# EAGLE schematic hh2019_proto (EAGLE 9.2.2)
Assembly variants: PRODUCTION

## Sheet 1 of 3
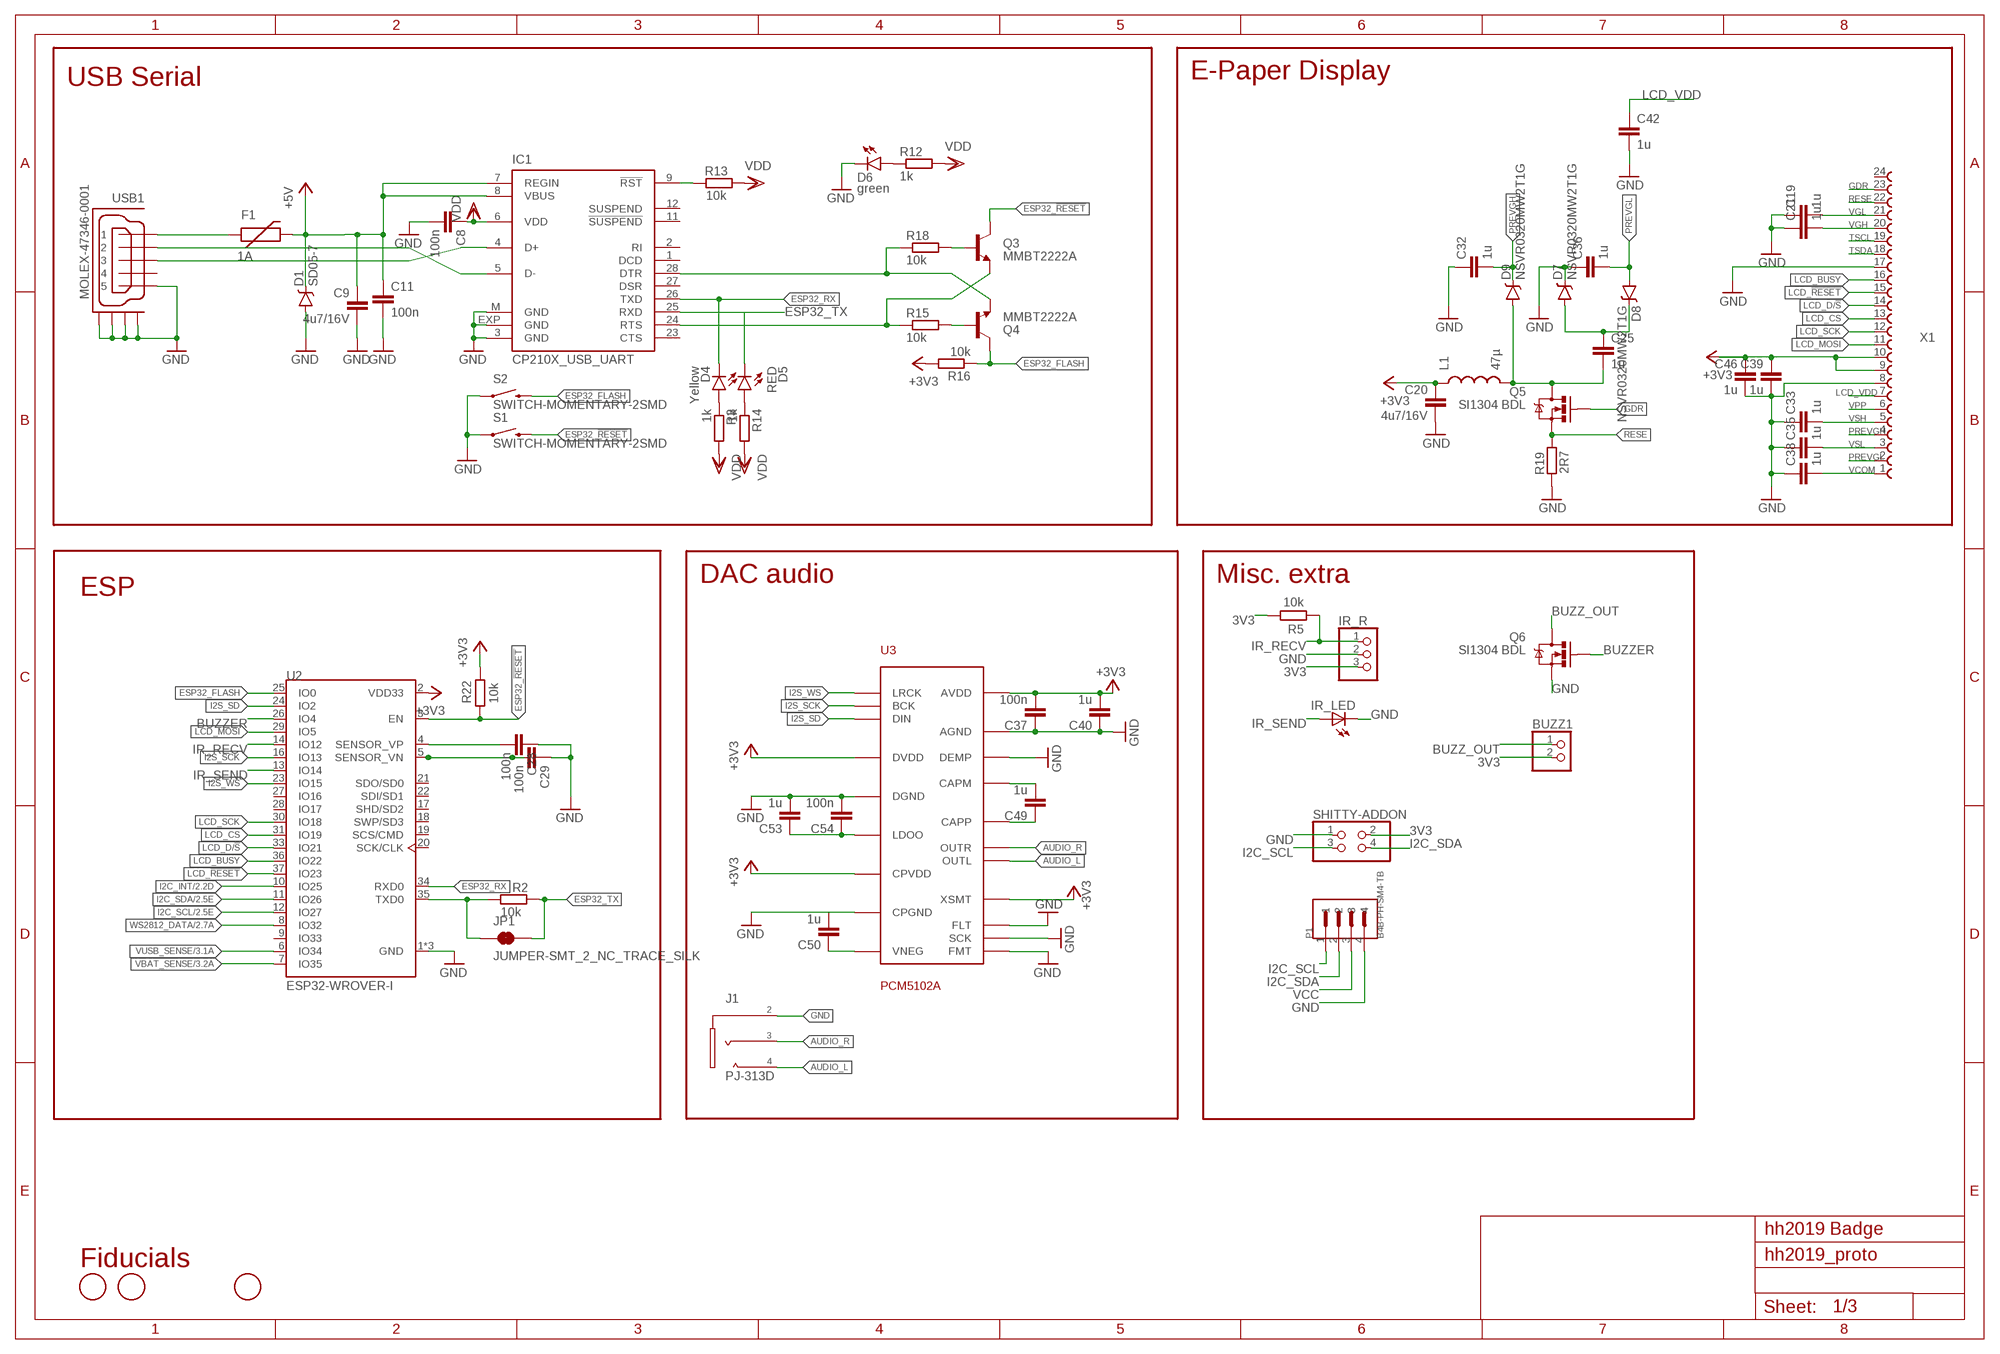
[diagram p0: schematic, sheet 1]

### Parts
BUZZ1  PINHD-1X2  [1X02]
C8  100n  C0603-DASHES  [C0603-DASHES]
C9  4u7/16V  C-EUC0805  [C0805]
C11  100n  C0603-DASHES  [C0603-DASHES]
C19  1u  C0603-DASHES  [C0603-DASHES]
C20  4u7/16V  C-EUC0805  [C0805]
C21  1u  C0603-DASHES  [C0603-DASHES]
C25  1u  C0603-DASHES  [C0603-DASHES]
C28  100n  C0603-DASHES  [C0603-DASHES]
C29  100n  C0603-DASHES  [C0603-DASHES]
C32  1u  C0603-DASHES  [C0603-DASHES]
C33  1u  C0603-DASHES  [C0603-DASHES]
C35  1u  C0603-DASHES  [C0603-DASHES]
C36  1u  C0603-DASHES  [C0603-DASHES]
C37  100n  C-EUC0603  [C0603]
C38  1u  C0603-DASHES  [C0603-DASHES]
C39  1u  C0603-DASHES  [C0603-DASHES]
C40  1u  C-EUC0603  [C0603]
C42  1u  C0603-DASHES  [C0603-DASHES]
C46  1u  C0603-DASHES  [C0603-DASHES]
C49  1u  C-EUC0603  [C0603]
C50  1u  C-EUC0603  [C0603]
C53  1u  C-EUC0603  [C0603]
C54  100n  C-EUC0603  [C0603]
D1  SD05-7  DIODE-SCHOTTKY-PMEG4005EJ  [SOD-323]
D4  Yellow  LED0603  [LED-0603]
D5  RED  LED0603  [LED-0603]
D6  green  LED0603  [LED-0603]
D7  NSVR0320MW2T1G  BAT20JFILM  [SOD-323]
D8  NSVR0320MW2T1G  BAT20JFILM  [SOD-323]
D9  NSVR0320MW2T1G  BAT20JFILM  [SOD-323]
F1  1A  PTCSMD  [PTC-1206]
FD1  FIDUCIAL  [FIDUCIAL_1MM]
FD4  FIDUCIAL  [FIDUCIAL_1MM]
FD5  FIDUCIAL  [FIDUCIAL_1MM]
IC1  CP210X_USB_UART  [MLP28]
IR_LED  LED5MM  [LED5MM]
IR_R  PINHD-1X3  [1X03]
J1  PJ-313D  [PJ-313D]
JP1  JUMPER-SMT_2_NC_TRACE_SILK  [SMT-JUMPER_2_NC_TRACE_SILK]
L1  47µ  INDUCTOR1210  [1210]
P1  B4B-PH-SM4-TB  [JST_B4B-PH-SM4-TB]
Q3  MMBT2222A  TRANSISTOR_NPNMMBT2222A  [SOT23-3]
Q4  MMBT2222A  TRANSISTOR_NPNMMBT2222A  [SOT23-3]
Q5  SI1304 BDL  MOSFET-NCHANNEL2N7002PW  [SOT323]
Q6  SI1304 BDL  MOSFET-NCHANNEL2N7002PW  [SOT323]
R2  10k  R0603-DASHES  [R0603-DASHES]
R3  1k  R0603-DASHES  [R0603-DASHES]
R5  10k  R0603-DASHES  [R0603-DASHES]
R12  1k  R0603-DASHES  [R0603-DASHES]
R13  10k  R0603-DASHES  [R0603-DASHES]
R14  1k  R0603-DASHES  [R0603-DASHES]
R15  10k  R0603-DASHES  [R0603-DASHES]
R16  10k  R0603-DASHES  [R0603-DASHES]
R18  10k  R0603-DASHES  [R0603-DASHES]
R19  2R7  R0603-DASHES  [R0603-DASHES]
R22  10k  R0603-DASHES  [R0603-DASHES]
S1  SWITCH-MOMENTARY-2SMD  [TACTILE-SWITCH-SMD]
S2  SWITCH-MOMENTARY-2SMD  [TACTILE-SWITCH-SMD]
SHITTY-ADDON  PINHD-2X2  [2X02]
U2  ESP32-WROVER-I  [XCVR_ESP32-WROVER-I]
U3  PCM5102A  [PCM5102A]
USB1  MOLEX-47346-0001  [MOLEX-47364-0001]
X1  68712414022  [68712414022]

### Nets
3V3: BUZZ1.2 C20.1 C37.2 C39.1 C40.2 C46.1 IR_R.3 L1.1 R5.1 R16.2 R22.1 SHITTY-ADDON.2 U2.2(VDD33) U3.P$1(CPVDD) U3.P$8(AVDD) U3.P$17(XSMT) U3.P$20(DVDD) X1.9 X1.10 ; supply symbol labelled +3V3 ; also sheet 2
+5V [GND/3V3]: C9.1 C11.1 D1.C F1.2 IC1.7(REGIN) IC1.8(VBUS) ; also sheet 2,3
AUDIO_L: J1.4_1 J1.4_2 U3.P$6(OUTL)
AUDIO_R: J1.3_1 J1.3_2 U3.P$7(OUTR)
BUZZ_OUT: BUZZ1.1 Q6.3(D)
BUZZER: Q6.1(G) U2.26(IO4)
CAPM: C49.2 U3.P$4(CAPM)
CAPP: C49.1 U3.P$2(CAPP)
ESP32_!RESET: Q3.3(C) R22.2 S1.3 U2.3(EN)
ESP32_FLASH: Q4.3(C) R16.1 S2.3 U2.25(IO0)
ESP32_RX: D4.C IC1.26(TXD) U2.34(RXD0)
ESP32_TX: D5.C IC1.25(RXD) JP1.2 R2.1
ESP32_TX_PRE: JP1.1 R2.2 U2.35(TXD0)
GDR: Q5.1(G) X1.23
GND [GND/3V3]: C8.2 C9.2 C11.2 C19.1 C20.2 C21.1 C28.1 C29.1 C32.1 C33.1 C35.1 C36.1 C37.1 C38.1 C39.2 C40.1 C42.2 C46.2 C50.2 C53.2 C54.2 D1.A D6.C D7.C IC1.3(GND) IC1.EXP(GND) IC1.M(GND) IR_LED.K(C) IR_R.2 J1.2_1 J1.2_2 P1.4 Q6.2(S) R19.2 S1.1 S2.1 SHITTY-ADDON.1 U2.1(GND) U2.15(GND) U2.38(GND) U3.P$3(CPGND) U3.P$9(AGND) U3.P$10(DEMP) U3.P$11(FLT) U3.P$12(SCK) U3.P$16(FMT) U3.P$19(DGND) USB1.5 USB1.GND1 USB1.GND2 USB1.GND3 USB1.GND4 X1.8 X1.17 ; also sheet 2,3
I2C_INT: U2.10(IO25) ; also sheet 2
I2C_SCL: P1.1 SHITTY-ADDON.3 U2.12(IO27) ; also sheet 2
I2C_SDA: P1.2 SHITTY-ADDON.4 U2.11(IO26) ; also sheet 2
I2S_SCK: U2.16(IO13) U3.P$13(BCK)
I2S_SD: U2.24(IO2) U3.P$14(DIN)
I2S_WS: U2.23(IO15) U3.P$15(LRCK)
IR_RECV: IR_R.1 R5.2 U2.14(IO12)
IR_SEND: IR_LED.A U2.13(IO14)
LCD_!RESET: U2.37(IO23) X1.15
LCD_BUSY: U2.36(IO22) X1.16
LCD_CS: U2.31(IO19) X1.13
LCD_D/!S: U2.33(IO21) X1.14
LCD_MOSI: U2.29(IO5) X1.11
LCD_SCK: U2.30(IO18) X1.12
LCD_VDD: C42.1 X1.7
LDO0: C53.1 C54.1 U3.P$18(LDOO)
N$10: IC1.24(RTS) Q3.2(E) R15.1
N$11: IC1.28(DTR) Q4.2(E) R18.1
N$13: Q4.1(B) R15.2
N$14: Q3.1(B) R18.2
N$22: C25.1 D7.A D8.C
N$23: C25.2 D9.A L1.2 Q5.3(D)
N$26: D6.A R12.1
N$27: D4.A R3.1
N$28: D5.A R14.1
N$32 [GND/3V3]: F1.1 USB1.1
N$42: C28.2 U2.4(SENSOR_VP)
N$43: C29.2 U2.5(SENSOR_VN)
PREVGH: C32.2 D9.C X1.4
PREVGL: C36.2 D8.A X1.2
RESE: Q5.2(S) R19.1 X1.22
RST: IC1.9(!RST) R13.2
TSCL: X1.19
TSDA: X1.18
USB_DN_CON: IC1.5(D-) USB1.2
USB_DP_CON: IC1.4(D+) USB1.3
VBAT_SENSE: U2.7(IO35) ; also sheet 3
VCC [FAT]: P1.3 ; also sheet 2
VCOM: C38.2 X1.1
VDD: C8.1 IC1.6(VDD) R3.2 R12.2 R13.1 R14.2
VGH: C21.2 X1.20
VGL: C19.2 X1.21
VNEG: C50.1 U3.P$5(VNEG)
VPP: X1.6
VSH: C33.2 X1.5
VSL: C35.2 X1.3
VUSB_SENSE: U2.6(IO34) ; also sheet 3
WS2812_DATA: U2.8(IO32) ; also sheet 2
Unconnected: IC1.1(DCD) IC1.2(RI) IC1.11(!SUSPEND) IC1.12(SUSPEND) IC1.23(CTS) IC1.27(DSR) U2.9(IO33) U2.17(SHD/SD2) U2.18(SWP/SD3) U2.19(SCS/CMD) U2.20(SCK/CLK) U2.21(SDO/SD0) U2.22(SDI/SD1) U2.27(IO16) U2.28(IO17) USB1.4 X1.24

### Notes on the sheet
- USB Serial | E-Paper Display
- DAC audio | Misc. extra
- ESP
- hh2019 Badge
- Fiducials

## Sheet 2 of 3
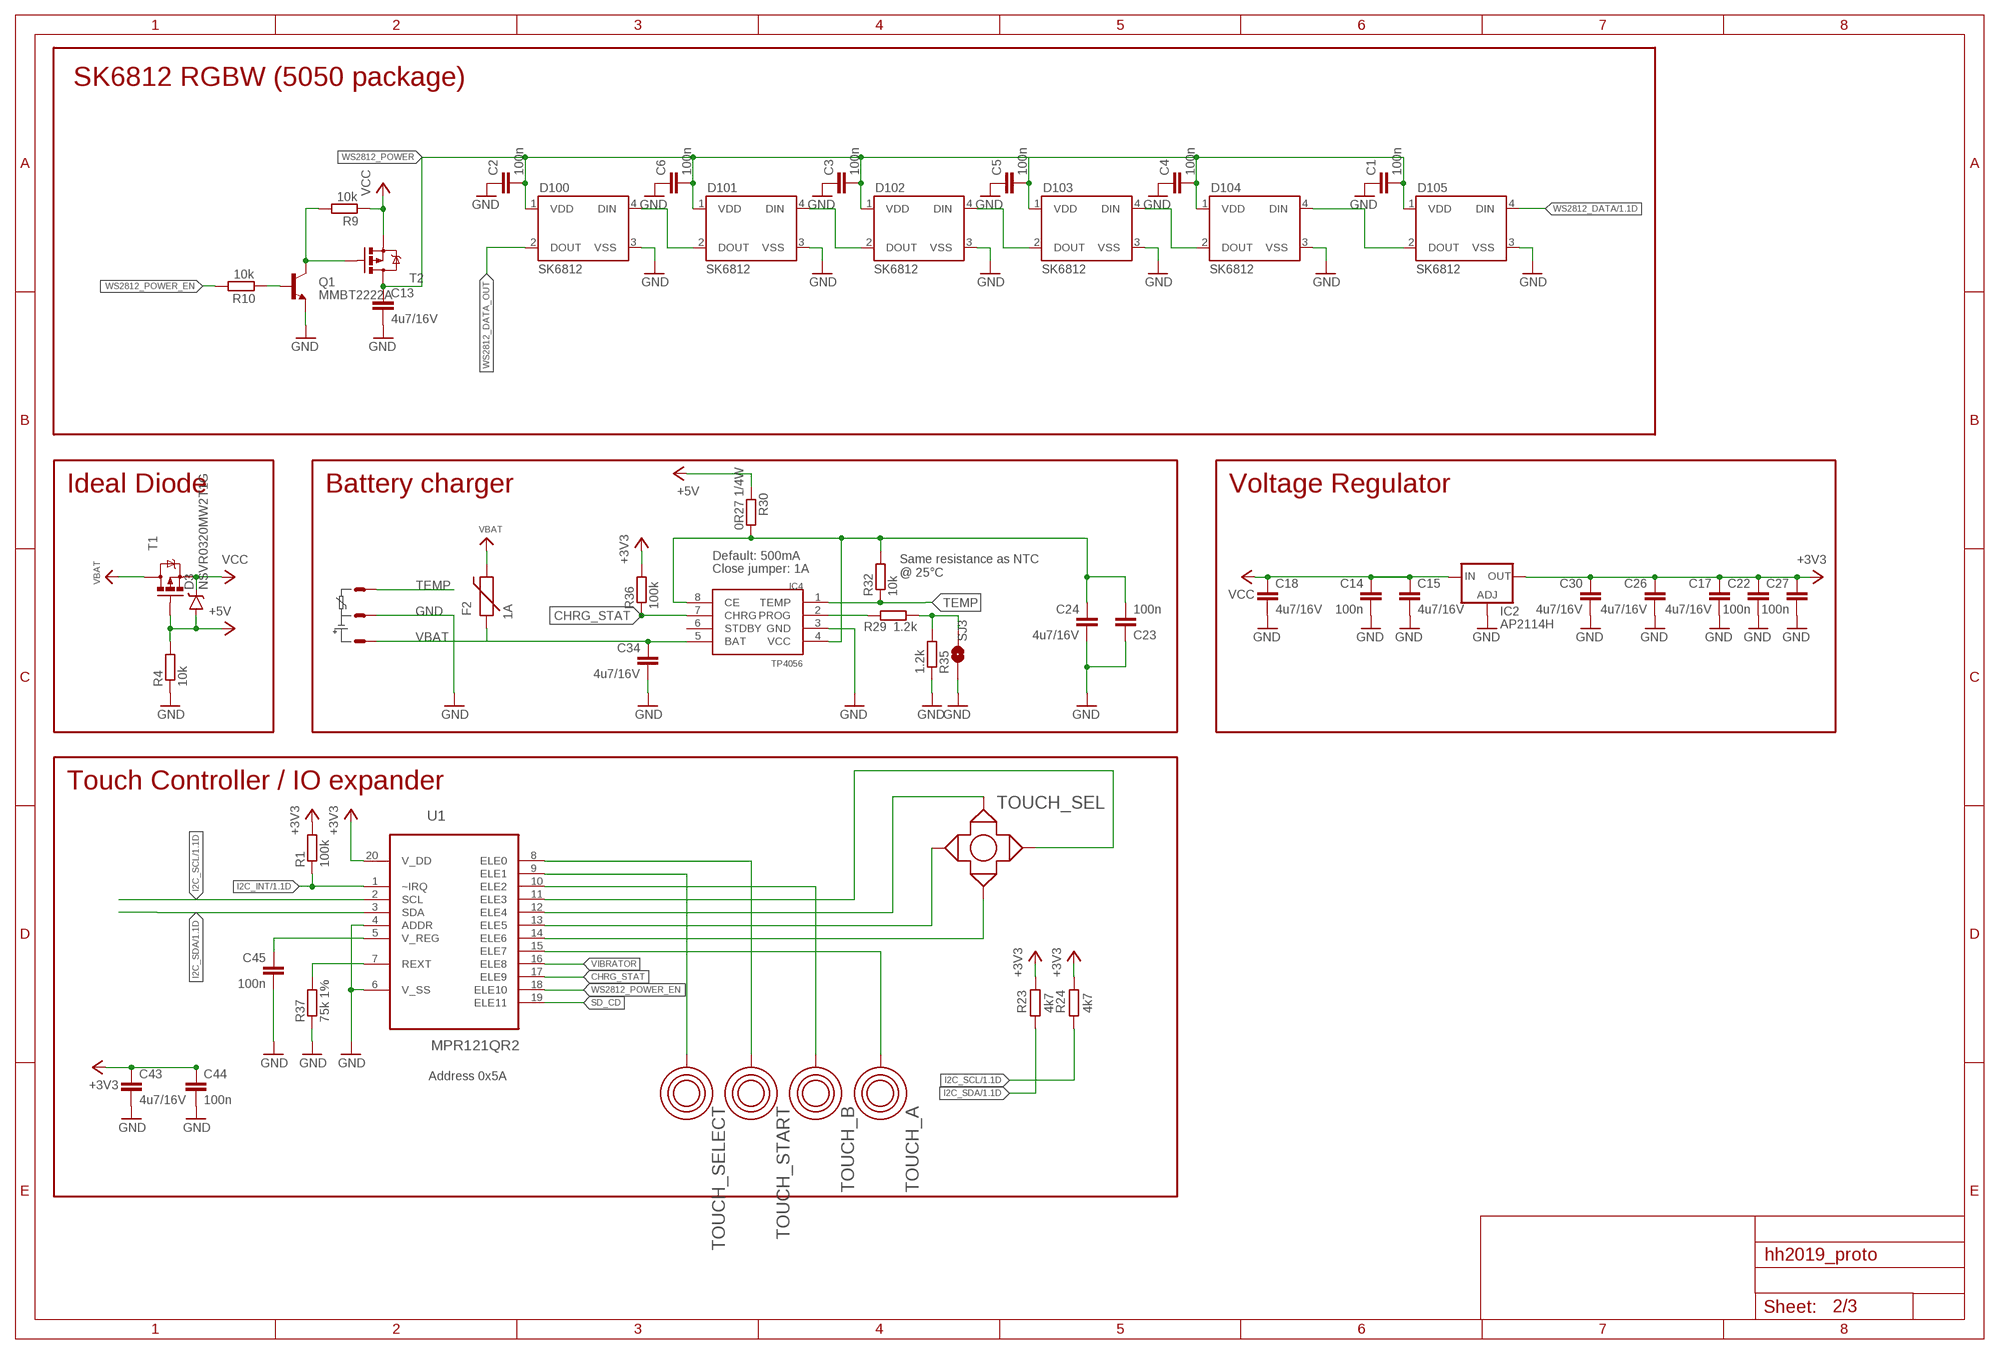
[diagram p1: schematic, sheet 2]

### Parts
C1  100n  C0603-DASHES  [C0603-DASHES]
C2  100n  C0603-DASHES  [C0603-DASHES]
C3  100n  C0603-DASHES  [C0603-DASHES]
C4  100n  C0603-DASHES  [C0603-DASHES]
C5  100n  C0603-DASHES  [C0603-DASHES]
C6  100n  C0603-DASHES  [C0603-DASHES]
C13  4u7/16V  C-EUC0805  [C0805]
C14  100n  C0603-DASHES  [C0603-DASHES]
C15  4u7/16V  C-EUC0805  [C0805]
C17  4u7/16V  C-EUC0805  [C0805]
C18  4u7/16V  C-EUC0805  [C0805]
C22  100n  C0603-DASHES  [C0603-DASHES]
C23  100n  C0603-DASHES  [C0603-DASHES]
C24  4u7/16V  C-EUC0805  [C0805]
C26  4u7/16V  C-EUC0805  [C0805]
C27  100n  C0603-DASHES  [C0603-DASHES]
C30  4u7/16V  C-EUC0805  [C0805]
C34  4u7/16V  C-EUC0805  [C0805]
C43  4u7/16V  C-EUC0805  [C0805]
C44  100n  C0603-DASHES  [C0603-DASHES]
C45  100n  C0603-DASHES  [C0603-DASHES]
D3  NSVR0320MW2T1G  BAT20JFILM  [SOD-323]
D100  SK6812  WS2812B  [WS2812B]
D101  SK6812  WS2812B  [WS2812B]
D102  SK6812  WS2812B  [WS2812B]
D103  SK6812  WS2812B  [WS2812B]
D104  SK6812  WS2812B  [WS2812B]
D105  SK6812  WS2812B  [WS2812B]
F2  1A  PTCSMD  [PTC-1206]
IC2  AP2114H  LD117AS33TR  [SOT223]
IC4  TP4056  [SOP-8]
Q1  MMBT2222A  TRANSISTOR_NPNMMBT2222A  [SOT23-3]
R1  100k  R0603-DASHES  [R0603-DASHES]
R4  10k  R0603-DASHES  [R0603-DASHES]
R9  10k  R0603-DASHES  [R0603-DASHES]
R10  10k  R0603-DASHES  [R0603-DASHES]
R23  4k7  R0603-DASHES  [R0603-DASHES]
R24  4k7  R0603-DASHES  [R0603-DASHES]
R29  1.2k  R0603-DASHES  [R0603-DASHES]
R30  0R27 1/4W  R-EU_R1206  [R1206]
R32  10k  R0603-DASHES  [R0603-DASHES]
R35  1.2k  R0603-DASHES  [R0603-DASHES]
R36  100k  R0603-DASHES  [R0603-DASHES]
R37  75k 1%  R0603-DASHES  [R0603-DASHES]
SJ3  JUMPER-PAD-2-NOYES_SILK  [PAD-JUMPER-2-NO_YES_SILK]
T1  MOSFET-PCHANNEL  [SOT23-3]
T2  MOSFET-PCHANNEL  [SOT23-3]
TOUCH_A  TOUCHROUND  [TOUCH_BUTTON]
TOUCH_B  TOUCHROUND  [TOUCH_BUTTON]
TOUCH_SEL  TOUCH_CROSS  [TOUCH_CROSS]
TOUCH_SELECT  TOUCHSELECT  [TOUCH_SELECT]
TOUCH_START  TOUCHSELECT  [TOUCH_SELECT]
U1  MPR121QR2  [QFN40P300X300X60-20N]
X4  JST-PH3  [JST-PH3]

### Nets
3V3: C17.1 C22.1 C26.1 C27.1 C30.1 C43.1 C44.1 IC2.4(OUT) R1.2 R23.1 R24.1 R36.2 U1.20(V_DD) ; supply symbol labelled +3V3 ; also sheet 1
+5V [GND/3V3]: D3.A R4.2 R30.1 T1.1(G) ; also sheet 1,3
BAT [FAT]: C34.1 F2.1 IC4.5(BAT) X4.3
CE [GND/3V3]: C23.2 C24.1 IC4.4(VCC) IC4.8(CE) R30.2 R32.2
CHRG_STAT: IC4.7(CHRG) R36.1 U1.17(ELE9)
ELE0 [Touch]: TOUCH_START.P$1 U1.8(ELE0)
ELE1 [Touch]: TOUCH_SELECT.P$1 U1.9(ELE1)
ELE2 [Touch]: TOUCH_B.P$1 U1.10(ELE2)
ELE3 [Touch]: TOUCH_SEL.R(RIGHT) U1.11(ELE3)
ELE4 [Touch]: TOUCH_SEL.UP U1.12(ELE4)
ELE5 [Touch]: TOUCH_SEL.L(LEFT) U1.13(ELE5)
ELE6 [Touch]: TOUCH_SEL.D(DOWN) U1.14(ELE6)
ELE7 [Touch]: TOUCH_A.P$1 U1.15(ELE7)
GND [GND/3V3]: C1.1 C2.1 C3.1 C4.1 C5.1 C6.1 C13.2 C14.2 C15.2 C17.2 C18.2 C22.2 C23.1 C24.2 C26.2 C27.2 C30.2 C34.2 C43.2 C44.2 C45.2 D100.3(VSS) D101.3(VSS) D102.3(VSS) D103.3(VSS) D104.3(VSS) D105.3(VSS) IC2.1(ADJ) IC4.3(GND) Q1.2(E) R4.1 R35.2 R37.1 SJ3.1 U1.4(ADDR) U1.6(V_SS) X4.2 ; also sheet 1,3
I2C_INT: R1.1 U1.1(~IRQ) ; also sheet 1
I2C_SCL: R24.2 U1.2(SCL) ; also sheet 1
I2C_SDA: R23.2 U1.3(SDA) ; also sheet 1
N$2: D100.4(DIN) D101.2(DOUT)
N$3: D103.4(DIN) D104.2(DOUT)
N$4: D104.4(DIN) D105.2(DOUT)
N$9: R29.2 R35.1 SJ3.2
N$19: D101.4(DIN) D102.2(DOUT)
N$20: C45.1 U1.5(V_REG)
N$21: R37.2 U1.7(REXT)
N$50: D102.4(DIN) D103.2(DOUT)
N$52: Q1.1(B) R10.2
N$53: Q1.3(C) R9.1 T2.1(G)
PROG: IC4.2(PROG) R29.1
SD_CD: U1.19(ELE11)
TEMP: IC4.1(TEMP) R32.1 X4.1
VBAT [FAT]: F2.2 T1.3(D) ; also sheet 3
VCC [FAT]: C14.1 C15.1 C18.1 D3.C IC2.3(IN) R9.2 T1.2(S) T2.2(S) ; also sheet 1
VIBRATOR: U1.16(ELE8)
WS2812_DATA: D105.4(DIN) ; also sheet 1
WS2812_DATA_OUT: D100.2(DOUT)
WS2812_POWER: C1.2 C2.2 C3.2 C4.2 C5.2 C6.2 C13.1 D100.1(VDD) D101.1(VDD) D102.1(VDD) D103.1(VDD) D104.1(VDD) D105.1(VDD) T2.3(D)
WS2812_POWER_EN: R10.1 U1.18(ELE10)
Unconnected: IC4.6(STDBY)

### Notes on the sheet
- SK6812 RGBW (5050 package)
- Ideal Diode | Battery charger | Voltage Regulator
- Default: 500mA
- Close jumper: 1A
- Same resistance as NTC
  @ 25°C
- GND
- VBAT
- Touch Controller / IO expander
- Address 0x5A

## Sheet 3 of 3
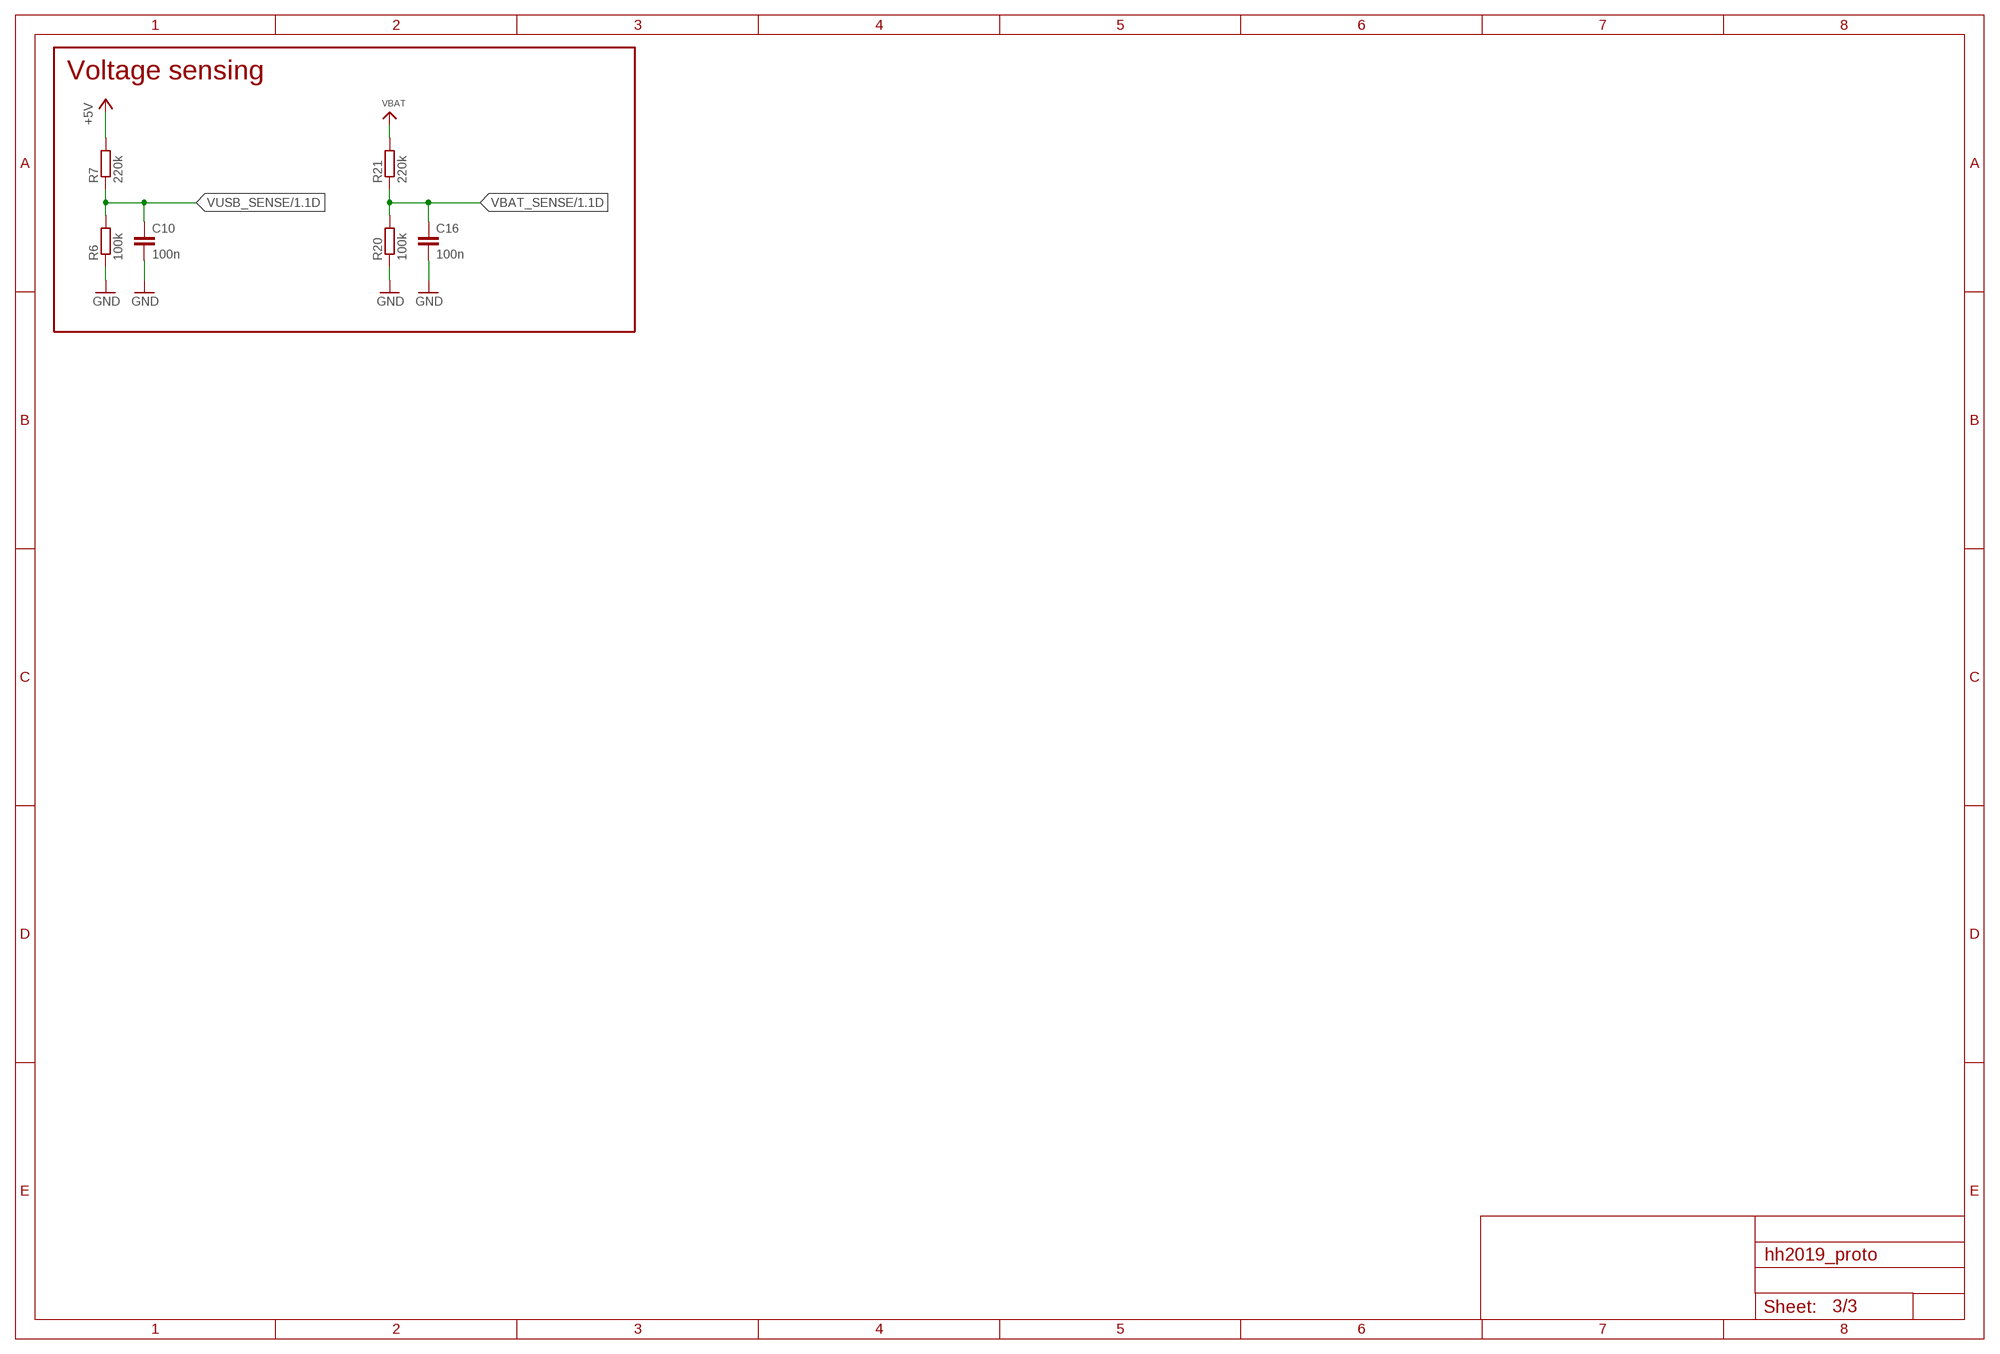
[diagram p2: schematic, sheet 3]

### Parts
C10  100n  C0603-DASHES  [C0603-DASHES]
C16  100n  C0603-DASHES  [C0603-DASHES]
R6  100k  R0603-DASHES  [R0603-DASHES]
R7  220k  R0603-DASHES  [R0603-DASHES]
R20  100k  R0603-DASHES  [R0603-DASHES]
R21  220k  R0603-DASHES  [R0603-DASHES]

### Nets
+5V [GND/3V3]: R7.2 ; also sheet 1,2
GND [GND/3V3]: C10.2 C16.2 R6.1 R20.1 ; also sheet 1,2
VBAT [FAT]: R21.2 ; also sheet 2
VBAT_SENSE: C16.1 R20.2 R21.1 ; also sheet 1
VUSB_SENSE: C10.1 R6.2 R7.1 ; also sheet 1

### Notes on the sheet
- Voltage sensing

## Library data of the parts
BUZZ1 = pinhead:PINHD-1X2: PIN HEADER
C1-C6 C8 C11 C14 C22 C23 C27 C44 C45 = hh2019_proto:C0603-DASHES; PARTNO: GRM188R71H104KA93D
C9 C13 C15 C17 C18 C20 C24 C26 C30 C34 C43 = rcl:C-EU: CAPACITOR, European symbol; PARTNO: GRM21BR61C475KA88K
C10 C16 C28 C29 = hh2019_proto:C0603-DASHES; OC_FARNELL: unknown; PARTNO: GRM188R71H104KA93D
C19 C21 C25 C32 C33 C35 C36 C38 C39 C42 C46 = hh2019_proto:C0603-DASHES; PARTNO: GRM188R61E105KA12D
C37 C40 C49 C50 C53 C54 = rcl:C-EU: CAPACITOR, European symbol; SPICEPREFIX: C
D1 = SparkFun-DiscreteSemi:DIODE-SCHOTTKY: Schottky diodes in SFE's production catalog BAT20J 1A 23V 0.62Vf RB751 120mA 40V 0.37Vf PMEG4005EJ 0.5A 40V 0.42Vf MBRA140 1A 40V 0.5Vf B340A 3A 40V SMA; PARTNO: SD05-7; PROD_ID: DIO-10955; VALUE: PMEG4005EJ
D3 D7-D9 = SparkFun-DiscreteSemi:BAT20JFILM: 23V, 1A Schottky diode, SOD-323 package; PARTNO: BAT20JFILM; PROD_ID: DIO-11623; VALUE: BAT20JFILM
D4-D6 = SparkFun-LED:LED: LEDs Standard schematic elements and footprints for 5mm, 3mm, 1206, and 0603 sized LEDs. 5mm - Spark Fun Electronics SKU : COM-00529 (and others)
D100-D105 = SparkFun-LED:WS2812B: WS2812B - Intelligent control LED integrated light source Technical Specifications: Power Supply Voltage (VDD): 3.5 to 5.3 V Input Voltage (VI): -0.5 to VDD+0.5 V Operating Junction Temperature (Topt): -25°C to +80°C Storage Temperature Range (Tstg): -55°C to +150°C; PARTNO: SK6812
F1 F2 = SparkFun-PowerIC:PTC: Resettable Fuse PTC Resettable Fuse. Spark Fun Electronics SKU : COM-08357; PROD_ID: RES-11150
FD1 FD4 FD5 = adafruit:FIDUCIAL: For use by pick and place machines to calibrate the vision/machine, 1mm By microbuilder.eu; OC_FARNELL: unknown; PARTNO: NAP
IC1 = SparkFun-DigitalIC:CP210X_USB_UART: Single-Chip USB to UART Bridge Source: www.silabs.com .. CP2101.pdf / cp2102.pdf. Spark Fun Electronics SKU : COM-00310; PARTNO: CP2102-GMR
IC2 = v-reg:LD117A?*: Low drop fixed and adjustable positive voltage regulators 1 A Source: http://www.st.com/stonline/products/literature/ds/7194/ld1117axx.pdf; PARTNO: AP7215-33YG-13
IC4 = TP4056:TP4056
IR_LED = led:LED: LED OSRAM: - CHIPLED LG R971, LG N971, LY N971, LG Q971, LY Q971, LO R971, LY R971 LH N974, LH R974 LS Q976, LO Q976, LY Q976 LO Q996 - Hyper CHIPLED LW Q18S LB Q993, LB Q99A, LB R99A - SideLED LS A670, LO A670, LY A670, LG A670, LP A670 LB A673, LV A673, LT A673, LW A673 LH A674 LY A675 LS A676, LA A676, LO A676, LY A676, LW A676 LS A679, LY A679, LG A679 - Hyper Micro SIDELED® LS Y876, LA Y876, LO Y876, LY Y876 LT Y87S - SmartLED LW L88C, LW L88S LB L89C, LB L89S, LG L890 LS L89K, LO L89K, LY L89K LS L896, LA L896, LO L896, LY L896 - TOPLED LS T670, LO T670, LY T670, LG T670, LP T670 LSG T670, LSP T670, LSY T670, LOP T670, LYG T670 LG T671, LOG T671, LSG T671 LB T673, LV T673, LT T673, LW T673 LH T674 LS T676, LA T676, LO T676, LY T676, LB T676, LH T676, LSB T676, LW T676 LB T67C, LV T67C, LT T67C, LS T67K, LO T67K, LY T67K, LW E67C LS E67B, LA E67B, LO E67B, LY E67B, LB E67C, LV E67C, LT E67C LW T67C LS T679, LY T679, LG T679 LS T770, LO T770, LY T770, LG T770, LP T770 LB T773, LV T773, LT T773, LW T773 LH T774 LS E675, LA E675, LY E675, LS T675 LS T776, LA T776, LO T776, LY T776, LB T776 LHGB T686 LT T68C, LB T68C - Hyper Mini TOPLED® LB M676 - Mini TOPLED Santana® LG M470 LS M47K, LO M47K, LY M47K Source: http://www.osram.convergy.de LUXEON: - LUMILED® LXK2-PW12-R00, LXK2-PW12-S00, LXK2-PW14-U00, LXK2-PW14-V00 LXK2-PM12-R00, LXK2-PM12-S00, LXK2-PM14-U00 LXK2-PE12-Q00, LXK2-PE12-R00, LXK2-PE12-S00, LXK2-PE14-T00, LXK2-PE14-U00 LXK2-PB12-K00, LXK2-PB12-L00, LXK2-PB12-M00, LXK2-PB14-N00, LXK2-PB14-P00, LXK2-PB14-Q00 LXK2-PR12-L00, LXK2-PR12-M00, LXK2-PR14-Q00, LXK2-PR14-R00 LXK2-PD12-Q00, LXK2-PD12-R00, LXK2-PD12-S00 LXK2-PH12-R00, LXK2-PH12-S00 LXK2-PL12-P00, LXK2-PL12-Q00, LXK2-PL12-R00 Source: www.luxeon.com KINGBRIGHT: KA-3528ASYC Source: www.kingbright.com
IR_R = pinhead:PINHD-1X3: PIN HEADER
J1 = audioconn:PJ-313: 3.5mm jack description Brover Geldrop MK
JP1 = SparkFun-Jumpers:JUMPER-SMT_2_NC_TRACE: Normally closed trace jumper This jumper has a trace between two pads so it's normally closed (NC). Use a razor knife to open the connection. For best results follow the IPC guidelines for cutting traces: Cutout at least 0.063 mm (0.005 in). Remove all loose material to clean up the cut area. Seal the cut with an approved epoxy. Reapply solder to reclose the connection.
L1 = SparkFun-Passives:INDUCTOR: Inductors Basic Inductor/Choke - 0603 and 1206. Footprints are not proven and vary greatly between part numbers. SRN6045- 33uH, 20% 1.4A SDR0403-560KL - 56uH, 10%, 500mA RMS/740mA peak; PARTNO: NLCV32T-220K-EF
P1 = B4B-PH-SM4-TB:B4B-PH-SM4-TB: CONN HEADER PH TOP 4POS 2MM SMD; AVAILABILITY: Unavailable; DESCRIPTION: Socket; wire-board; male; PIN: 4; 2mm; SMT; PH; 100V; 2A; MF: JST; MP: B4B-PH-SM4-TB; PACKAGE: None; PRICE: None
Q1 Q3 Q4 = SparkFun-DiscreteSemi:TRANSISTOR_NPN: Generic NPN BJT MMBT2222A - TRANS-08049 (SOT-23, 1A 40V) MPSA42 - TRANS-09116 (SOT-23, 500mA 300V) MMBT5088LT1G - TRANS-11160 (SOT-23, 50 mA 30V) BC547 - COM-08928 (TO-92 45V 100mA) (1.Collector 2.Base 3.Emitter) 2N3904 - COM-00521 (TO-92 40V 200mA) (1.Emitter 2.Base 3.Collector) P2N2222A - COM-12852 (TO-92 40V 600mA) (1.Collector 2.Base 3.Emitter); PARTNO: BC817-25,215; PROD_ID: TRANS-08049
Q5 Q6 = SparkFun-DiscreteSemi:MOSFET-NCHANNEL: Common NMOSFET Parts MFG P/N Store ID Prod ID FDD8780 TRANS-09984 SI7820DN TRANS-11055 FDS6630A IC-08089 2N7002PW TRANS-11151 FQP30N06L COM-10213 TRANS-10060 BSS123LT1G TRANS-08345 BSS138 TRANS-00830 BS170 2N7000; PARTNO: SI1308EDL-T1-GE3; PROD_ID: TRANS-11151
R1 R6 R20 R36 R37 = hh2019_proto:R0603-DASHES; PARTNO: ERJ-3GEYJ104V
R2 R4 R13 R15 R16 R18 = hh2019_proto:R0603-DASHES; PARTNO: ERJ-3GEYJ103V
R3 R12 R14 = hh2019_proto:R0603-DASHES; PARTNO: ERJ-3GEYJ102V
R5 R22-R24 = hh2019_proto:R0603-DASHES; OC_FARNELL: unknown; PARTNO: ERJ-3GEYJ103V
R7 R21 = hh2019_proto:R0603-DASHES; PARTNO: ERJ-3GEYJ224V
R9 R10 = 00ralf:R0603-DASHES; PARTNO: ERJ-3GEYJ103V
R19 = hh2019_proto:R0603-DASHES; PARTNO: ERJ-3GEYJ5R1V
R29 R35 = hh2019_proto:R0603-DASHES; PARTNO: ERJ-3GEYJ222V
R30 = rcl:R-EU_: RESISTOR, European symbol; PARTNO: ERJ-3GEYJ154V
R32 = hh2019_proto:R0603-DASHES; PARTNO: ERJ-3GEYJ154V
S1 S2 = SparkFun-Electromechanical:SWITCH-MOMENTARY-2: Various NO switches- pushbuttons, reed, etc; PARTNO: SKQGABE010; PROD_ID: SWCH-08247
SHITTY-ADDON = pinhead:PINHD-2X2: PIN HEADER
SJ3 = SparkFun-Passives:JUMPER-PAD-2-NO; PARTNO: NAP
T1 T2 = SparkFun-DiscreteSemi:MOSFET-PCHANNEL: Generic PMOSFET IRLML2244 - TRANS-11153 (SOT-23 -20V -4.3A) (1.Gate 2.Source 3.Drain) FQP27P06 - COM-10349 (TO-220 -60V -27A) (1.Gate 2.Source 3.Drain); PROD_ID: TRANS-08285
TOUCH_A TOUCH_B = badge:TOUCH; PARTNO: NAP
TOUCH_SEL = badge:TOUCH_CROSS; PARTNO: NAP
TOUCH_SELECT TOUCH_START = badge:TOUCH
U1 = Freescale_By_element14_Batch_1:MPR121QR2: Proximity Capacitive Touch Sensor Controller; MPN: MPR121QR2; OC_FARNELL: 1858714; OC_NEWARK: 24R9786; PACKAGE: QFN-20; SUPPLIER: Freescale
U2 = ESP32-WROVER-I-2:ESP32-WROVER-I: Module: combo; GPIO, I2C x2, I2S x2, SDIO, SPI x3, UART x3; U.FL; DESCRIPTION: Module: combo; GPIO, I2C x2, I2S x2, SDIO, SPI x3, UART x3; U.FL; DIGI-KEY_PART_NUMBER: 1904-1008-1-ND; DIGI-KEY_PURCHASE_URL: https://www.digikey.com/product-detail/en/espressif-systems/ESP32-WROVER-I/1904-1008-1-ND/8544303?utm_source=snapeda&utm_medium=aggregator&utm_campaign=symbol; MF: Espressif Systems; MP: ESP32-WROVER-I; PACKAGE: Module Espressif Systems
U3 = DMF-TI_DIR9001:PCM5102A: PCM5102A
USB1 = usb_con-update:MOLEX-47346-0001: MICRO USB B, BOTTOM MOUNT; PARTNO: 10118192-0001LF
X1 = EAGLE-FPC_CONNECTOR_AND_FFC_CAB-rev1:68712414022: WR-FPC 0.5mm SMT ZIF Horizontal Top Contact, 24 Pins=>Code : Con_FPC_ZIF_0.50_68712414022 Details see: http://katalog.we-online.de/en/em/687_1xx_140_22 Created 2014-07-09, Karrer Zheng 2014 (C) Würth Elektronik; PARTNO: 68712414022
X4 = badge:JST-PH3

## Net classes
1 FAT: width 0.2 mm, drill 0.4 mm
2 GND/3V3: width 0.2 mm, drill 0.4 mm
3 Touch: width 0.2 mm, clearance 1 mm
4 touch prox: width 0.2 mm, clearance 1.6 mm